# Altium schematic sheet Key-HT16K33.SchDoc
size A4
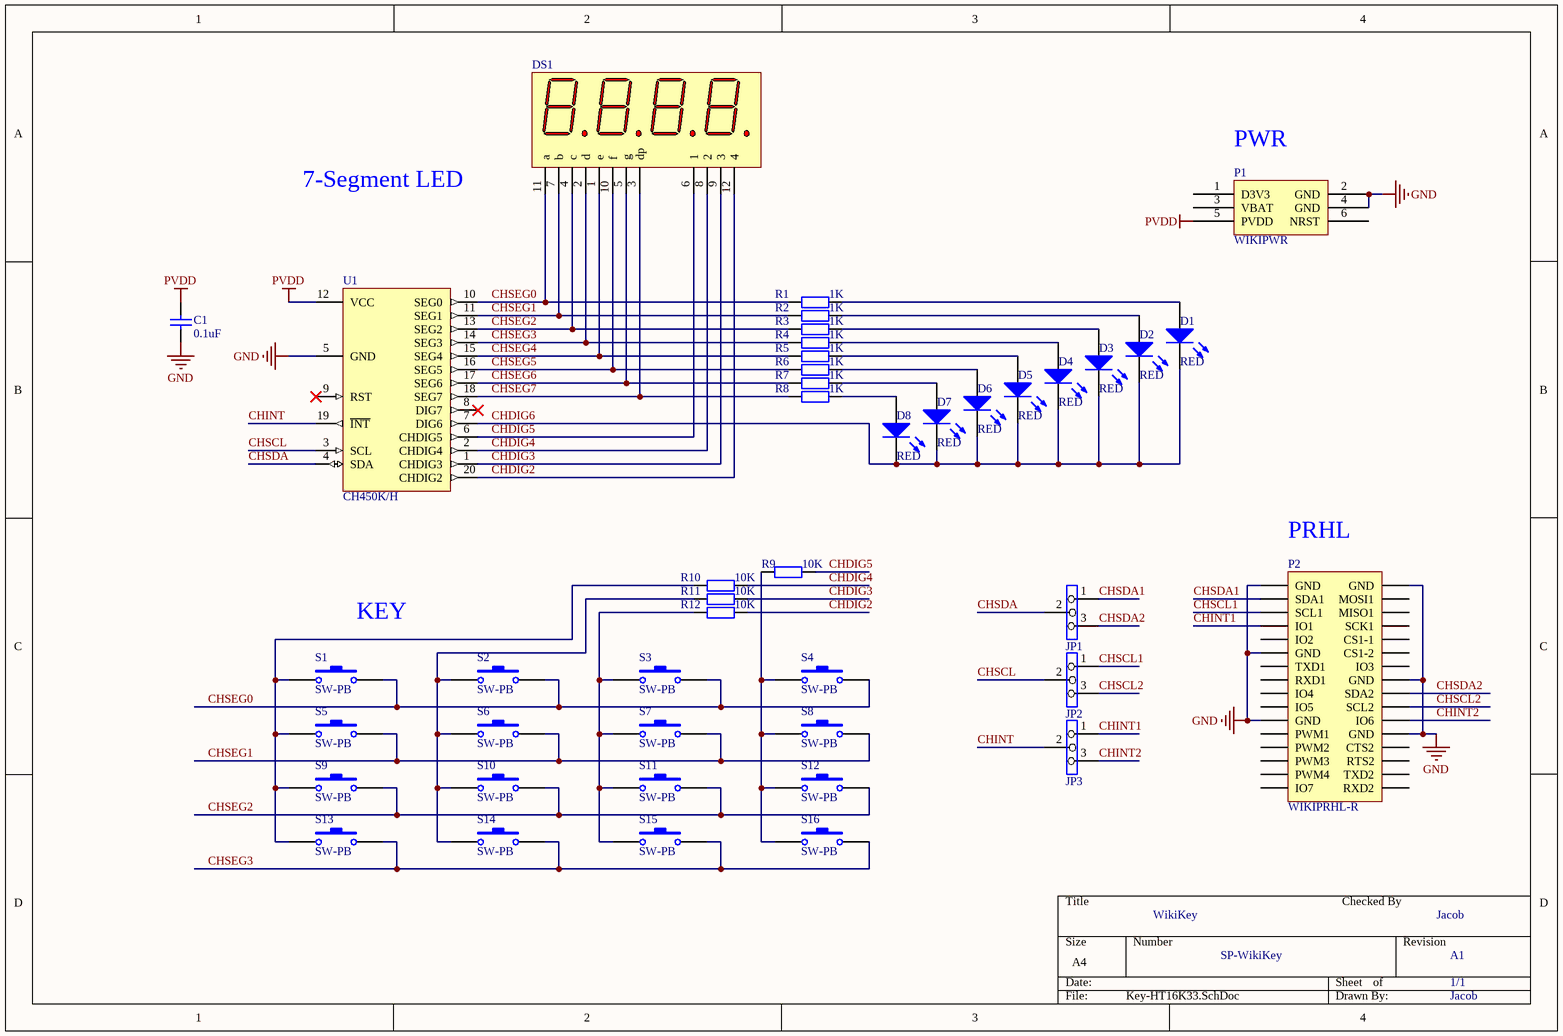
[diagram p0: Key-HT16K33.SchDoc]

## Parts
C1  0.1uF  [0603M]
D1  RED  [0603pn]
D2  RED  [0603pn]
D3  RED  [0603pn]
D4  RED  [0603pn]
D5  RED  [0603pn]
D6  RED  [0603pn]
D7  RED  [0603pn]
D8  RED  [0603pn]
DS1  7SEG-4  [7SGLED-4-0.28]  (value not drawn)
JP1  Jumper3  [HDR1X3/2.54MM]  (value not drawn)
JP2  Jumper3  [HDR1X3/2.54MM]  (value not drawn)
JP3  Jumper3  [HDR1X3/2.54MM]  (value not drawn)
P1  WIKIPWR  [WIKIPWR]
P2  WIKIPRHL-R  [HDR2X16-WIKIPRHL-R]
R1  1K  [0603M]
R2  1K  [0603M]
R3  1K  [0603M]
R4  1K  [0603M]
R5  1K  [0603M]
R6  1K  [0603M]
R7  1K  [0603M]
R8  1K  [0603M]
R9  10K  [0603M]
R10  10K  [0603M]
R11  10K  [0603M]
R12  10K  [0603M]
S1  SW-PB  [KEY-4.5X4.5-SMD]
S2  SW-PB  [KEY-4.5X4.5-SMD]
S3  SW-PB  [KEY-4.5X4.5-SMD]
S4  SW-PB  [KEY-4.5X4.5-SMD]
S5  SW-PB  [KEY-4.5X4.5-SMD]
S6  SW-PB  [KEY-4.5X4.5-SMD]
S7  SW-PB  [KEY-4.5X4.5-SMD]
S8  SW-PB  [KEY-4.5X4.5-SMD]
S9  SW-PB  [KEY-4.5X4.5-SMD]
S10  SW-PB  [KEY-4.5X4.5-SMD]
S11  SW-PB  [KEY-4.5X4.5-SMD]
S12  SW-PB  [KEY-4.5X4.5-SMD]
S13  SW-PB  [KEY-4.5X4.5-SMD]
S14  SW-PB  [KEY-4.5X4.5-SMD]
S15  SW-PB  [KEY-4.5X4.5-SMD]
S16  SW-PB  [KEY-4.5X4.5-SMD]
U1  CH450K/H  [SO20W_M]

## Nets
GND: C1.1 P1.2(GND) P1.4(GND) P2.1(GND) P2.2(GND) P2.11(GND) P2.16(GND) P2.21(GND) P2.24(GND) U1.5(GND)
PVDD: C1.2 P1.5(PVDD) U1.12(VCC)
CHDIG2: DS1.12(4) R12.1 U1.20(CHDIG2)
CHDIG3: DS1.9(3) R11.1 U1.1(CHDIG3)
CHDIG4: DS1.8(2) R10.1 U1.2(CHDIG4)
CHDIG5: DS1.6(1) R9.1 U1.6(CHDIG5)
CHDIG6: D1.2(K) D2.2(K) D3.2(K) D4.2(K) D5.2(K) D6.2(K) D7.2(K) D8.2(K) U1.7(DIG6)
CHINT: JP3.2 U1.19(~{INT})
CHINT1: JP3.1 P2.7(IO1)
CHINT2: JP3.3 P2.22(IO6)
CHSCL: JP2.2 U1.3(SCL)
CHSCL1: JP2.1 P2.5(SCL1)
CHSCL2: JP2.3 P2.20(SCL2)
CHSDA: JP1.2 U1.4(SDA)
CHSDA1: JP1.1 P2.3(SDA1)
CHSDA2: JP1.3 P2.18(SDA2)
CHSEG0: DS1.11(a) R1.2 S1.2 S2.2 S3.2 S4.2 U1.10(SEG0)
CHSEG1: DS1.7(b) R2.2 S5.2 S6.2 S7.2 S8.2 U1.11(SEG1)
CHSEG2: DS1.4(c) R3.2 S9.2 S10.2 S11.2 S12.2 U1.13(SEG2)
CHSEG3: DS1.2(d) R4.2 S13.2 S14.2 S15.2 S16.2 U1.14(SEG3)
CHSEG4: DS1.1(e) R5.2 U1.15(SEG4)
CHSEG5: DS1.10(f) R6.2 U1.16(SEG5)
CHSEG6: DS1.5(g) R7.2 U1.17(SEG6)
CHSEG7: DS1.3(dp) R8.2 U1.18(SEG7)
NetD1_1: D1.1(A) R1.1
NetD2_1: D2.1(A) R2.1
NetD3_1: D3.1(A) R3.1
NetD4_1: D4.1(A) R4.1
NetD5_1: D5.1(A) R5.1
NetD6_1: D6.1(A) R6.1
NetD7_1: D7.1(A) R7.1
NetD8_1: D8.1(A) R8.1
NetR9_2: R9.2 S4.1 S8.1 S12.1 S16.1
NetR10_2: R10.2 S1.1 S5.1 S9.1 S13.1
NetR11_2: R11.2 S2.1 S6.1 S10.1 S14.1
NetR12_2: R12.2 S3.1 S7.1 S11.1 S15.1

Not connected (* = marked no-connect by the designer): P1 1(D3V3) 3(VBAT) 6(NRST); P2 4(MOSI1) 6(MISO1) 8(SCK1) 9(IO2) 10(CS1-1) 12(CS1-2) 13(TXD1) 14(IO3) 15(RXD1) 17(IO4) 19(IO5) 23(PWM1) 25(PWM2) 26(CTS2) 27(PWM3) 28(RTS2) 29(PWM4) 30(TXD2) 31(IO7) 32(RXD2); U1 8(DIG7)* 9(RST)*

## Notes on the sheet
- (near DS1) Common-Cathoded
- (near P1) PWR
- 7-Segment LED
- (near P2) PRHL
- KEY
- WikiKey
- Checked By
- Jacob
- SP-WikiKey
- A1
- 1/1

## Library data of the parts
C1 = Cap: Capacitor; Published: 8-Jun-2000; LatestRevisionDate: 17-Jul-2002; LatestRevisionNote: Re-released for DXP Platform.; PackageReference: RAD-0.3; Publisher: Altium Limited; Value: 0.1uF
D1-D8 = LED0: Typical INFRARED GaAs LED; Published: 8-Jun-2000; LatestRevisionDate: 08-Jul-2005; LatestRevisionNote: Mech Layer 1 removed.; PackageReference: LED-0; Publisher: Altium Limited
DS1 = 7SEG-4: Black Surface HER 7-Segment Display; MinimumIntensity: 360 ucd; Note: IF = 5 mA; Colour: High Efficiency Red (HER); Note: Pins 1 and 6 are redundant Cathodes.; Published: 8-Jun-2000; LatestRevisionDate: 17-Dec-2003; LatestRevisionNote: Schematic revised, PCB Footprint replaced.; DatasheetDocument: 19-Feb-2002; PackageDocument: 19-Feb-2002; PackageReference: LEDDIP-10; Publisher: Altium Limited; ComponentLink1Description: Manufacturer Link; ComponentLink1URL: http://www.agilent.com/
P1 = WIKIPWR: PWR HDR
P2 = WIKIPRHL-R: Header, 16-Pin, Dual row; LatestRevisionDate: 17-Jul-2002; LatestRevisionNote: Re-released for DXP Platform.; Publisher: Altium Limited
R1-R12 = Res2: Resistor; Published: 8-Jun-2000; LatestRevisionDate: 17-Jul-2002; LatestRevisionNote: Re-released for DXP Platform.; PackageReference: AXIAL-0.4; Publisher: Altium Limited
  R1-R8: Value: 1K
  R9-R12: Value: 10K
S1-S16 = SW-PB: Switch; Published: 24-Mar-1999; LatestRevisionDate: 17-Jul-2002; LatestRevisionNote: Re-released for DXP Platform.; PackageReference: SPST-2; Publisher: Altium Limited
U1 = CH450K/H: 7 Segment LED& Key